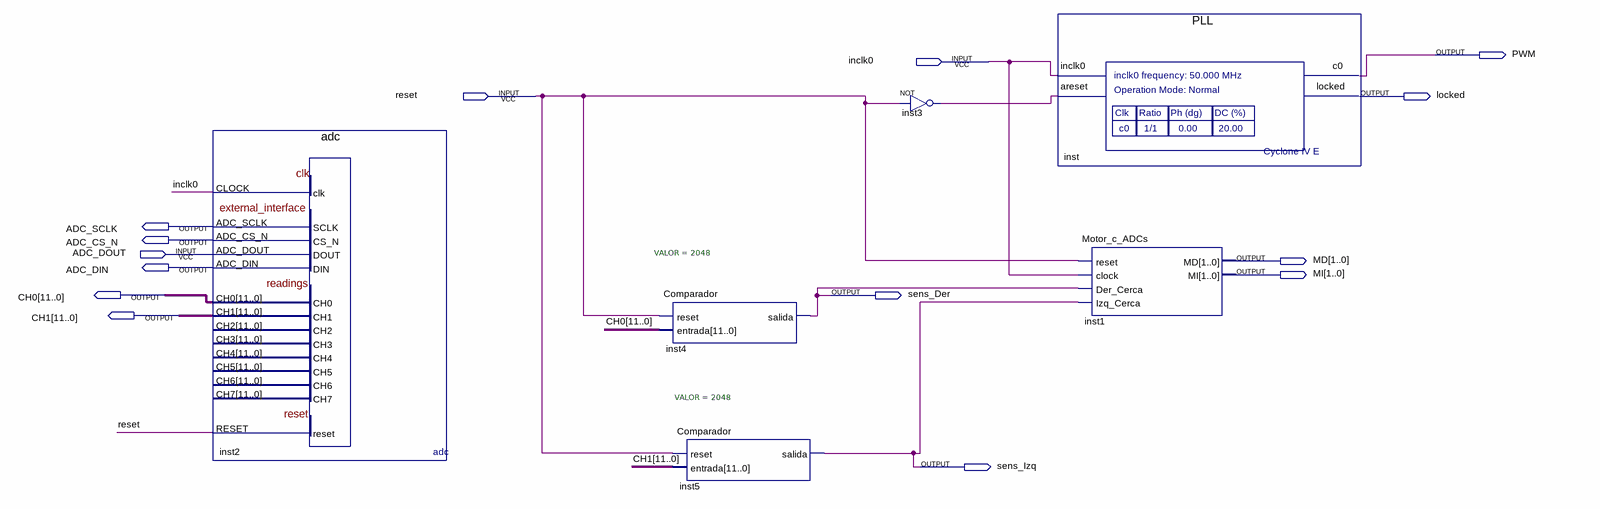
[diagram p0: schematic sheet]
// Quartus schematic Control_Motor.bdf as structural Verilog: 6 symbols, 14 pins
module Control_Motor (
  input  inclk0,
  input  reset,
  input  ADC_DOUT,
  output PWM,
  output locked,
  output ADC_SCLK,
  output ADC_CS_N,
  output [1:0] MD,
  output ADC_DIN,
  output [1:0] MI,
  output [11:0] CH0,
  output sens_Der,
  output [11:0] CH1,
  output sens_Izq
);

  wire inst3_out;

  adc inst2 (
    .CLOCK(inclk0), .ADC_DOUT(ADC_DOUT), .RESET(reset), .ADC_SCLK(ADC_SCLK), .ADC_CS_N(ADC_CS_N),
    .ADC_DIN(ADC_DIN), .CH0(CH0), .CH1(CH1));  // open: CH2, CH3, CH4, CH5, CH6, CH7
  Comparador #(.VALOR(2048)) inst4 (.reset(reset), .entrada(CH0), .salida(sens_Der));
  Comparador #(.VALOR(2048)) inst5 (.reset(reset), .entrada(CH1), .salida(sens_Izq));
  not inst3 (inst3_out, reset);
  PLL inst (.inclk0(inclk0), .areset(inst3_out), .c0(PWM), .locked(locked));
  Motor_c_ADCs inst1 (.reset(reset), .clock(inclk0), .Der_Cerca(sens_Der), .Izq_Cerca(sens_Izq), .MD(MD), .MI(MI));
endmodule
